# EAGLE schematic 12 pin sop (EAGLE 7.2.0)
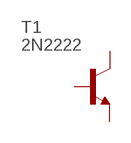
[diagram p0: schematic, sheet 1]

## Parts
T1  2N2222  [TO92-EBC-OVAL]
Unconnected: T1.B T1.C T1.E

## Library data of the parts
T1 = adafruit:2N2222: NPN TRANSISTOR Big oval pads